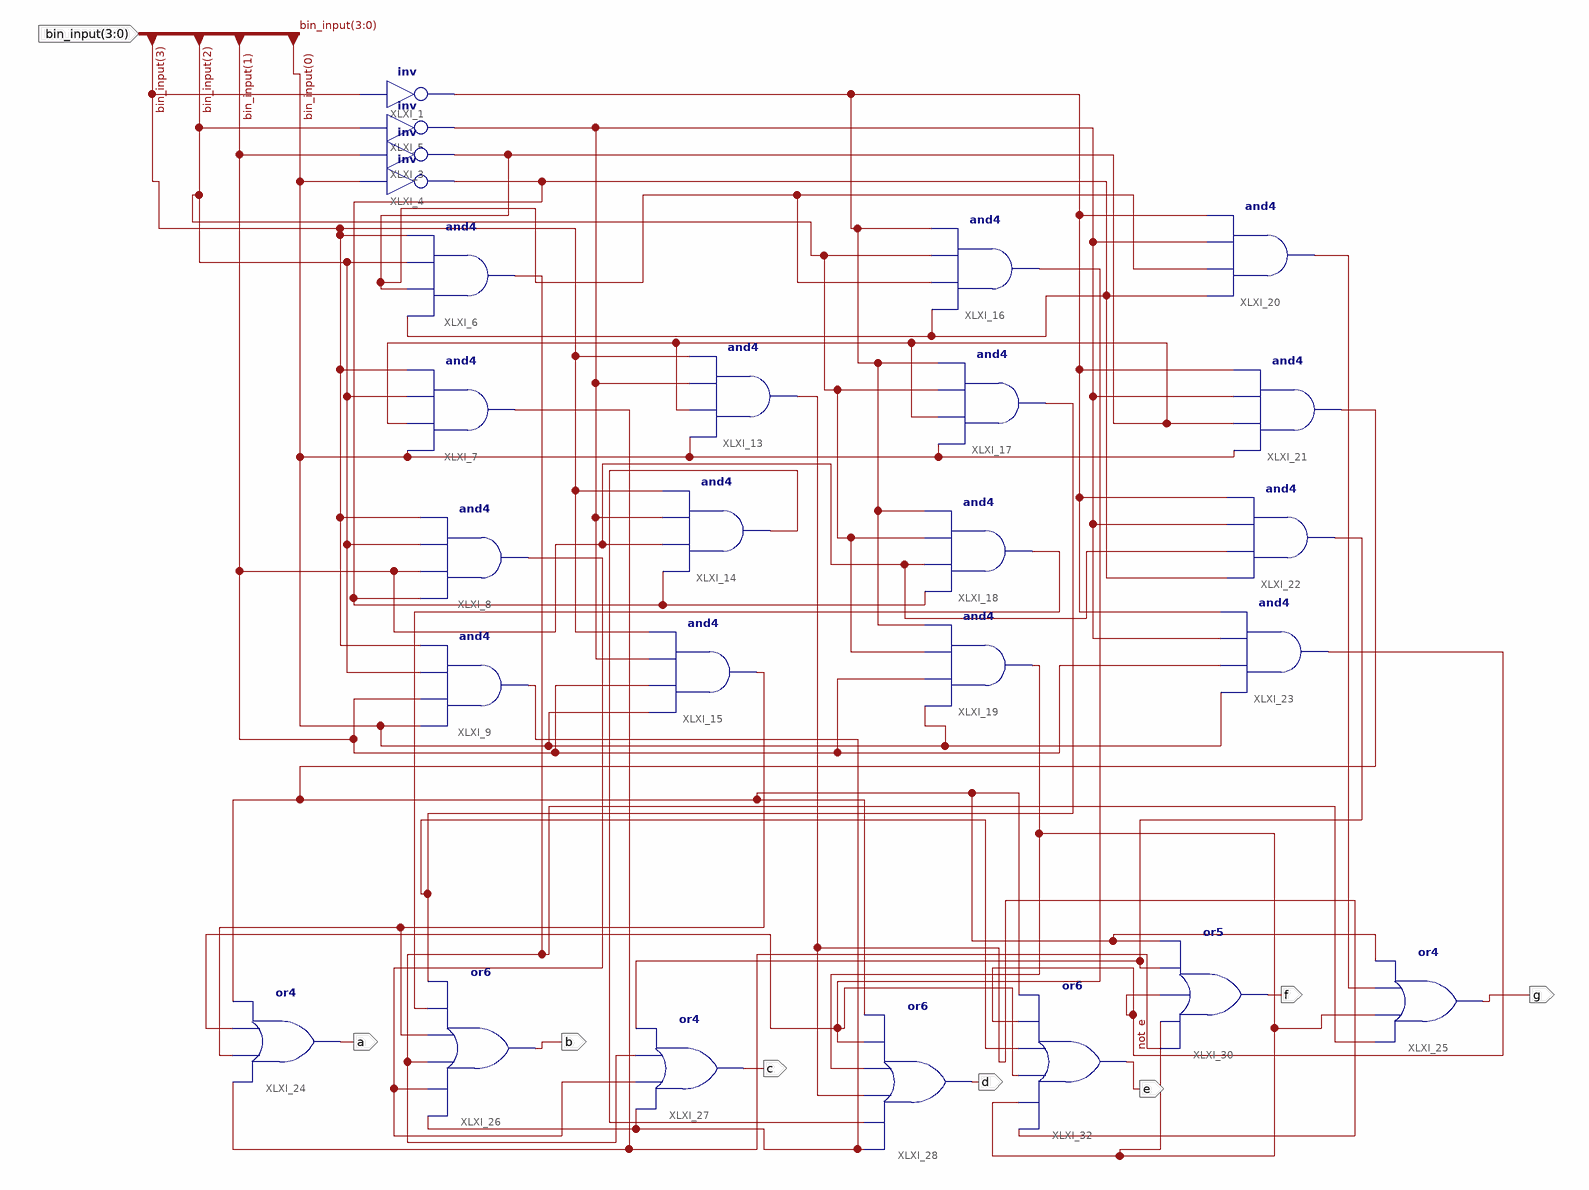
[diagram p0: schematic sheet 1]
// Xilinx ISE schematic bin_to_7_seg.sch (spartan3e) as structural Verilog: 26 symbols, 8 ports
module bin_to_7_seg (
  input  [3:0] bin_input,
  output a,
  output b,
  output c,
  output d,
  output g,
  output f,
  output e
);

  wire not_e, XLXN_13, XLXN_41, XLXN_68, XLXN_77, XLXN_79, XLXN_95, XLXN_102, XLXN_105, XLXN_112, XLXN_115,
       XLXN_116, XLXN_117, XLXN_119, XLXN_121, XLXN_132, XLXN_134, XLXN_139, XLXN_140;

  not XLXI_1 (XLXN_13, bin_input[3]);
  not XLXI_3 (XLXN_139, bin_input[1]);
  not XLXI_4 (XLXN_140, bin_input[0]);
  not XLXI_5 (XLXN_41, bin_input[2]);
  and XLXI_6 (XLXN_117, XLXN_140, XLXN_139, bin_input[2], bin_input[3]);
  and XLXI_7 (XLXN_116, bin_input[0], XLXN_139, bin_input[2], bin_input[3]);
  and XLXI_8 (XLXN_121, XLXN_140, bin_input[1], bin_input[2], bin_input[3]);
  and XLXI_9 (XLXN_119, bin_input[0], bin_input[1], bin_input[2], bin_input[3]);
  and XLXI_13 (XLXN_105, bin_input[0], XLXN_139, XLXN_41, bin_input[3]);
  and XLXI_14 (XLXN_112, XLXN_140, bin_input[1], XLXN_41, bin_input[3]);
  and XLXI_15 (XLXN_115, bin_input[0], bin_input[1], XLXN_41, bin_input[3]);
  and XLXI_16 (XLXN_134, XLXN_140, XLXN_139, bin_input[2], XLXN_13);
  and XLXI_17 (XLXN_132, bin_input[0], XLXN_139, bin_input[2], XLXN_13);
  and XLXI_18 (XLXN_95, XLXN_140, bin_input[1], bin_input[2], XLXN_13);
  and XLXI_19 (XLXN_102, bin_input[0], bin_input[1], bin_input[2], XLXN_13);
  and XLXI_20 (XLXN_77, XLXN_140, XLXN_139, XLXN_41, XLXN_13);
  and XLXI_21 (XLXN_68, bin_input[0], XLXN_139, XLXN_41, XLXN_13);
  and XLXI_22 (XLXN_79, XLXN_140, bin_input[1], XLXN_41, XLXN_13);
  and XLXI_23 (not_e, bin_input[0], bin_input[1], XLXN_41, XLXN_13);
  or XLXI_24 (a, XLXN_116, XLXN_115, XLXN_134, XLXN_68);
  or XLXI_25 (g, XLXN_117, XLXN_102, XLXN_77, XLXN_68);
  or XLXI_26 (b, XLXN_119, XLXN_121, XLXN_117, XLXN_115, XLXN_95, XLXN_132);
  or XLXI_27 (c, XLXN_119, XLXN_121, XLXN_117, XLXN_79);
  or XLXI_28 (d, XLXN_119, XLXN_112, XLXN_105, XLXN_102, XLXN_134, XLXN_68);
  or XLXI_30 (f, XLXN_116, XLXN_102, not_e, XLXN_79, XLXN_68);
  or XLXI_32 (e, XLXN_105, XLXN_102, XLXN_134, XLXN_132, not_e, XLXN_68);
endmodule
